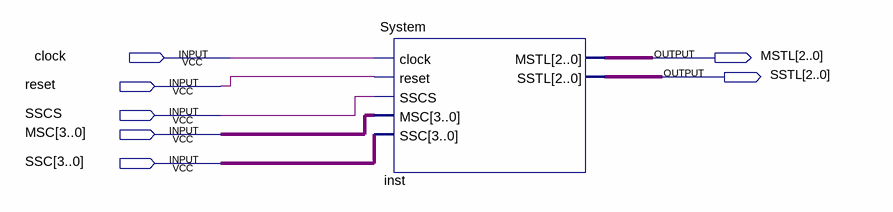
[diagram p0: schematic sheet]
// Quartus schematic Lab3_block.bdf as structural Verilog: 1 symbols, 7 pins
module Lab3_block (
  input  clock,
  input  reset,
  input  SSCS,
  input  [3:0] MSC,
  input  [3:0] SSC,
  output [2:0] MSTL,
  output [2:0] SSTL
);

  System inst (.clock(clock), .reset(reset), .SSCS(SSCS), .MSC(MSC), .SSC(SSC), .MSTL(MSTL), .SSTL(SSTL));
endmodule
